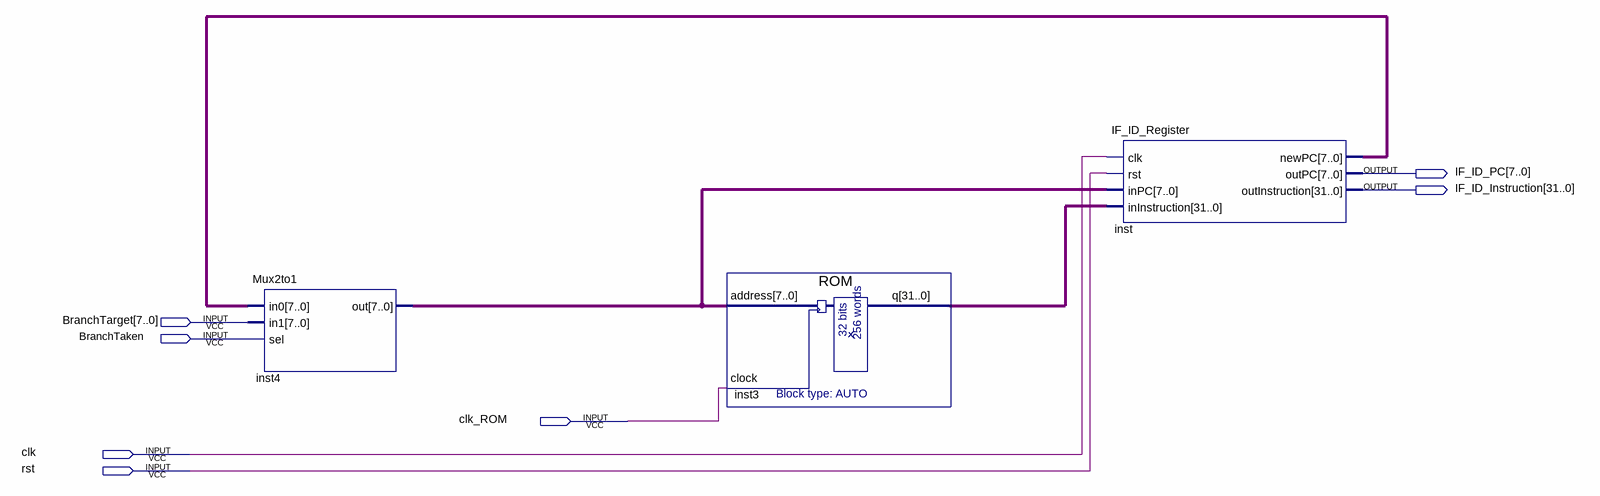
[diagram p0: schematic sheet]
// Quartus schematic IF_STAGE.bdf as structural Verilog: 3 symbols, 7 pins
module IF_STAGE (
  input  [7:0] BranchTarget,
  input  BranchTaken,
  input  clk_ROM,
  input  clk,
  input  rst,
  output [7:0] IF_ID_PC,
  output [31:0] IF_ID_Instruction
);

  wire [7:0] inst4_out, inst_newpc;
  wire [31:0] inst3_q;

  Mux2to1 inst4 (.in0(inst_newpc), .in1(BranchTarget), .sel(BranchTaken), .out(inst4_out));
  ROM inst3 (.address(inst4_out), .clock(clk_ROM), .q(inst3_q));
  IF_ID_Register inst (
    .clk(clk), .rst(rst), .inPC(inst4_out), .inInstruction(inst3_q), .newPC(inst_newpc), .outPC(IF_ID_PC),
    .outInstruction(IF_ID_Instruction));
endmodule
